# Altium project WreckerCar.PrjPcb
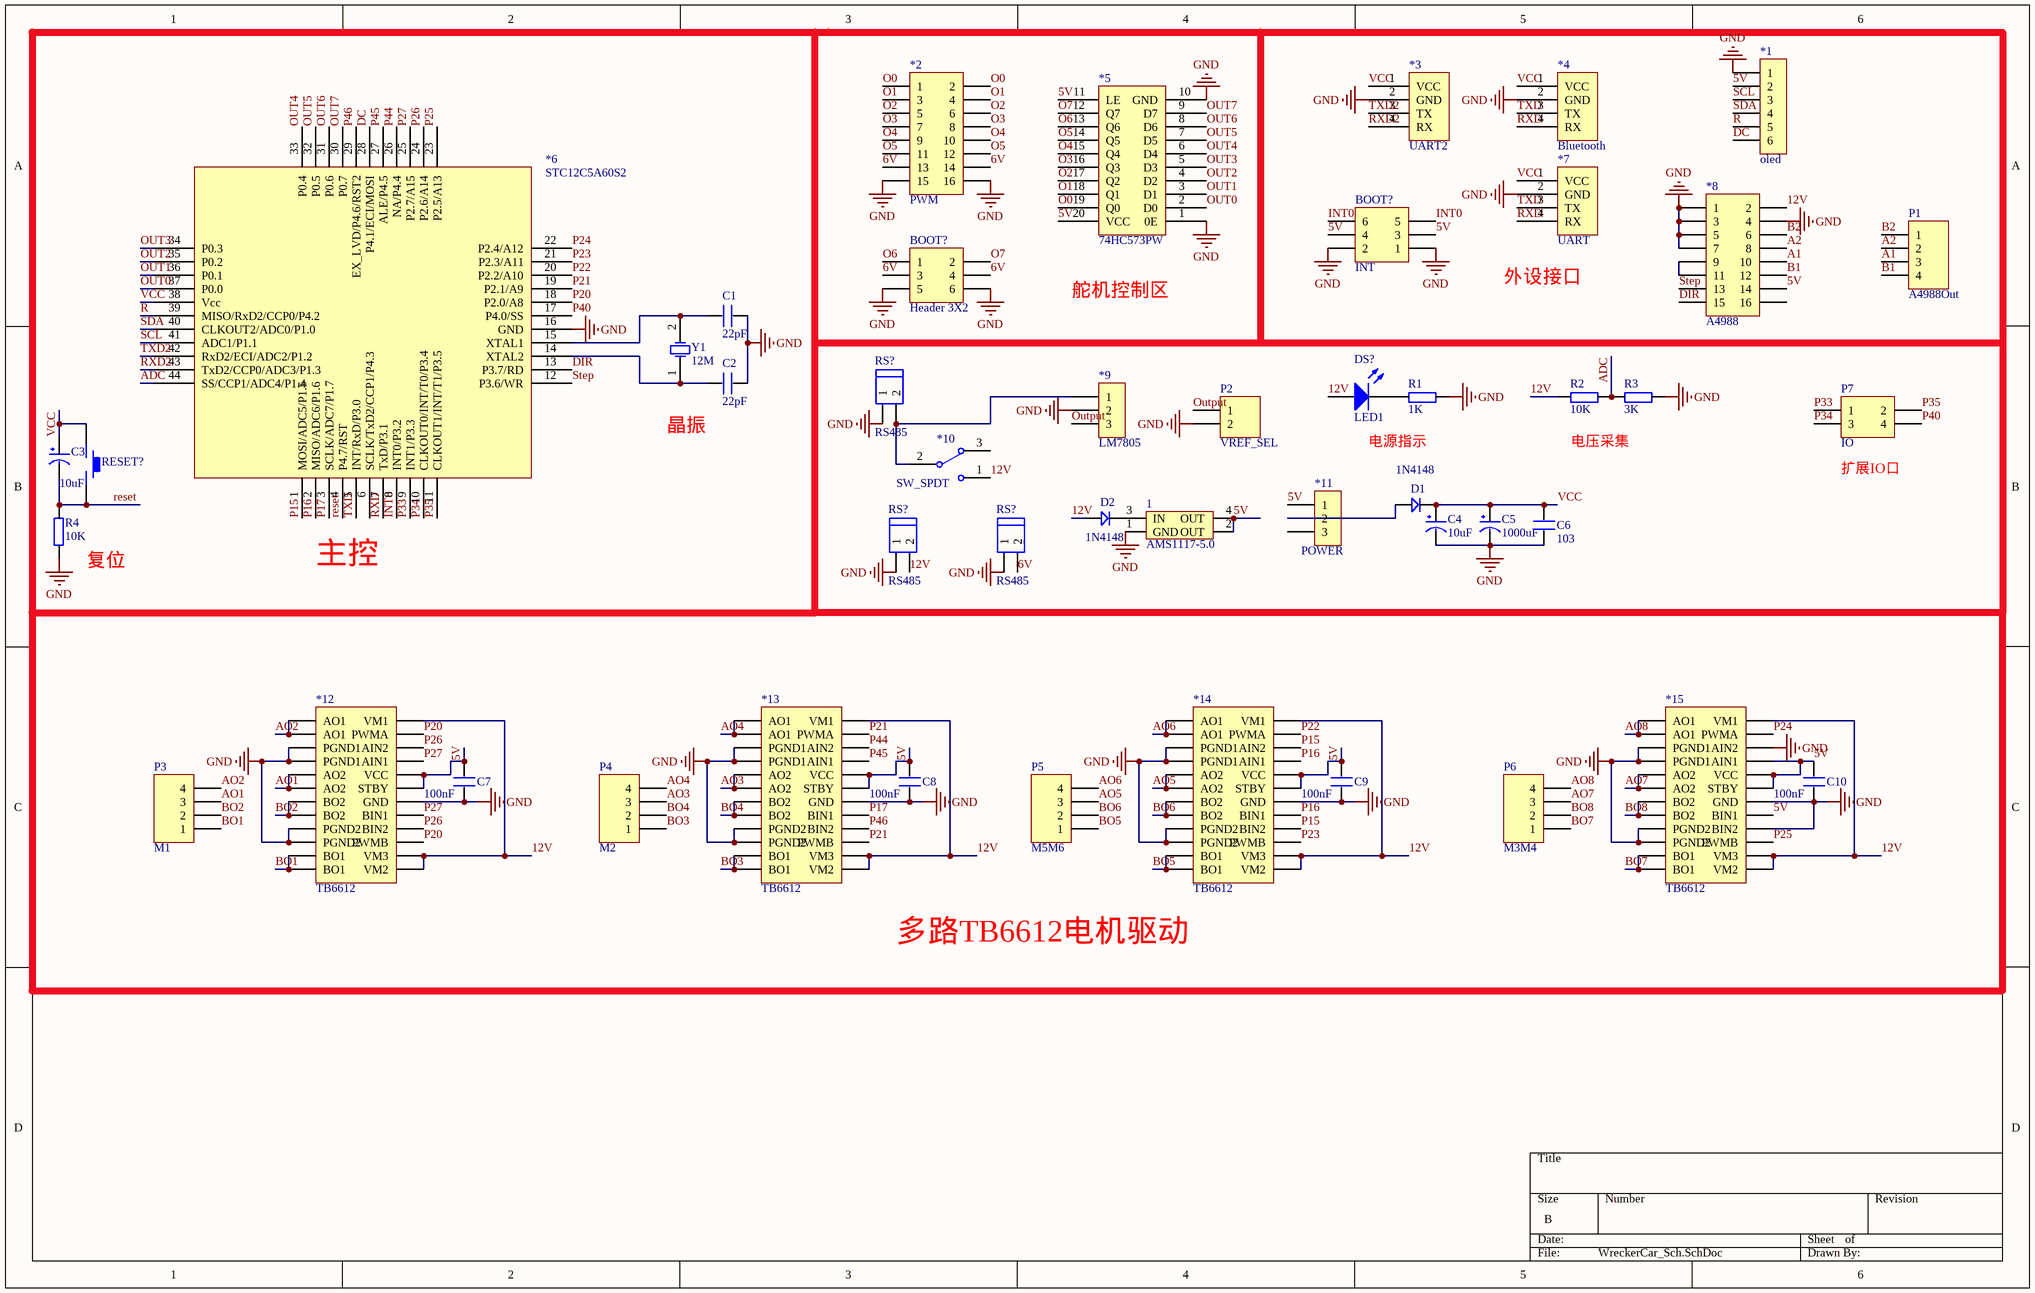
[diagram p0: WreckerCar_Sch.SchDoc]
1 sheet, 47 parts. Net scope: global (net labels, ports and power ports of the same name join across sheets).
Board file: WreckerCar_PCB.PcbDoc

## Sheet WreckerCar_Sch.SchDoc
size B

### Parts
(Parts that share a designator on the sheet are numbered #1, #2 ... from top to bottom, then left to right.)
1  AMS1117-5.0  [AMS1117]
*1  oled  [header1*6]
*2  PWM  [HEADER2*8]
*3  UART2  [HDR1X4]
*4  Bluetooth  [HDR1X4]
*5  74HC573PW  [TSSOP-20]
*6  STC12C5A60S2  [LQFP-44]
*7  UART  [HDR1X4]
*8  A4988  [A4988]
*9  LM7805  [header1*3]
*10  SW_SPDT  [钮子开关]
*11  POWER  [header1*3]
*12  TB6612  [TSOP65P760X120-24N]
*13  TB6612  [TSOP65P760X120-24N]
*14  TB6612  [TSOP65P760X120-24N]
*15  TB6612  [TSOP65P760X120-24N]
C1  22pF  [0603P]
C2  22pF  [0603P]
C3  10uF  [Cap10uF]
C4  10uF  [Cap10uF]
C5  1000uF  [Cap1000uF]
C6  103  [0603P]
C7  100nF  [0805]
C8  100nF  [0805]
C9  100nF  [0805]
C10  100nF  [0805]
D1  1N4148  [DIODE_SOP]
D2  1N4148  [DIODE_SOP]
DS  LED1  [SMDLED]
INT  INT  [HDR2X3]
P1  A4988Out  [HDR1X4]
P2  VREF_SEL  [HDR1X2]
P3  M1  [HDR1X4]
P4  M2  [HDR1X4]
P5  M5M6  [HDR1X4]
P6  M3M4  [HDR1X4]
P7  IO  [HDR2X2]
PWM2  Header 3X2  [HDR2X3]
R1  1K  [0603P]
R2  10K  [0603P]
R3  3K  [0603P]
R4  10K  [0603P]
RESET  KEY_M  [KEY]  (value not drawn)
RS#1  RS485  [HEAD2L-0.8]
RS#2  RS485  [HEAD2L-0.8]
RS#3  RS485  [HEAD2L-0.8]
Y1  12M  [XTAL_US]

### Nets
GND: 1.1(GND) *1.1 *2.15 *2.16 *3.2(GND) *4.2(GND) *5.1(0E) *5.10(GND) *6.16(GND) *7.2(GND) *8.1 *8.3 *8.4 *8.5 *8.7 *9.2 *12.3(PGND1) *12.4(PGND1) *12.9(PGND2) *12.10(PGND2) *12.18(GND) *13.3(PGND1) *13.4(PGND1) *13.9(PGND2) *13.10(PGND2) *13.18(GND) *14.3(PGND1) *14.4(PGND1) *14.9(PGND2) *14.10(PGND2) *14.18(GND) *15.3(PGND1) *15.4(PGND1) *15.9(PGND2) *15.10(PGND2) *15.16(BIN2) *15.18(GND) *15.22(AIN2) C1.2 C2.2 C4.2(GND) C5.2(GND) C6.1 C7.1 C8.1 C9.1 C10.1 INT.1 INT.2 P2.2 PWM2.5 PWM2.6 R1.2 R3.2 R4.2 RS#1.1 RS#2.1 RS#3.1
5V: 1.2(OUT) 1.4(OUT) *1.2 *5.11(LE) *5.20(VCC) *8.14 *11.1 *12.19(STBY) *12.20(VCC) *13.19(STBY) *13.20(VCC) *14.19(STBY) *14.20(VCC) *15.17(BIN1) *15.19(STBY) *15.20(VCC) *15.21(AIN1) C7.2 C8.2 C9.2 C10.2 INT.3 INT.4
6V: *2.13 *2.14 PWM2.3 PWM2.4 RS#3.2
12V: *8.2 *10.1 *12.13(VM2) *12.14(VM3) *12.24(VM1) *13.13(VM2) *13.14(VM3) *13.24(VM1) *14.13(VM2) *14.14(VM3) *14.24(VM1) *15.13(VM2) *15.14(VM3) *15.24(VM1) D2.1 DS.1(A) R2.1 RS#2.2
A1: *8.10 P1.3
A2: *8.8 P1.2
ADC: *6.44(SS/CCP1/ADC4/P1.4) R2.2 R3.1
AO1: *12.5(AO2) *12.6(AO2) P3.3
AO2: *12.1(AO1) *12.2(AO1) P3.4
AO3: *13.5(AO2) *13.6(AO2) P4.3
AO4: *13.1(AO1) *13.2(AO1) P4.4
AO5: *14.5(AO2) *14.6(AO2) P5.3
AO6: *14.1(AO1) *14.2(AO1) P5.4
AO7: *15.5(AO2) *15.6(AO2) P6.3
AO8: *15.1(AO1) *15.2(AO1) P6.4
B1: *8.12 P1.4
B2: *8.6 P1.1
BO1: *12.11(BO1) *12.12(BO1) P3.1
BO2: *12.7(BO2) *12.8(BO2) P3.2
BO3: *13.11(BO1) *13.12(BO1) P4.1
BO4: *13.7(BO2) *13.8(BO2) P4.2
BO5: *14.11(BO1) *14.12(BO1) P5.1
BO6: *14.7(BO2) *14.8(BO2) P5.2
BO7: *15.11(BO1) *15.12(BO1) P6.1
BO8: *15.7(BO2) *15.8(BO2) P6.2
DC: *1.6 *6.28(P4.1/ECI/MOSI)
DIR: *6.13(P3.7/RD) *8.15
INT0: *6.8(INT0/P3.2) INT.5 INT.6
O0: *2.1 *2.2 *5.19(Q0)
O1: *2.3 *2.4 *5.18(Q1)
O2: *2.5 *2.6 *5.17(Q2)
O3: *2.7 *2.8 *5.16(Q3)
O4: *2.9 *2.10 *5.15(Q4)
O5: *2.11 *2.12 *5.14(Q5)
O6: *5.13(Q6) PWM2.1
O7: *5.12(Q7) PWM2.2
OUT0: *5.2(D0) *6.37(P0.0)
OUT1: *5.3(D1) *6.36(P0.1)
OUT2: *5.4(D2) *6.35(P0.2)
OUT3: *5.5(D3) *6.34(P0.3)
OUT4: *5.6(D4) *6.33(P0.4)
OUT5: *5.7(D5) *6.32(P0.5)
OUT6: *5.8(D6) *6.31(P0.6)
OUT7: *5.9(D7) *6.30(P0.7)
Output: *9.3 P2.1
P15: *6.1(MOSI/ADC5/P1.5) *14.16(BIN2) *14.22(AIN2)
P16: *6.2(MISO/ADC6/P1.6) *14.17(BIN1) *14.21(AIN1)
P17: *6.3(SCLK/ADC7/P1.7) *13.17(BIN1)
P20: *6.18(P2.0/A8) *12.15(PWMB) *12.23(PWMA)
P21: *6.19(P2.1/A9) *13.15(PWMB) *13.23(PWMA)
P22: *6.20(P2.2/A10) *14.23(PWMA)
P23: *6.21(P2.3/A11) *14.15(PWMB)
P24: *6.22(P2.4/A12) *15.23(PWMA)
P25: *6.23(P2.5/A13) *15.15(PWMB)
P26: *6.24(P2.6/A14) *12.16(BIN2) *12.22(AIN2)
P27: *6.25(P2.7/A15) *12.17(BIN1) *12.21(AIN1)
P33: *6.9(INT1/P3.3) P7.1
P34: *6.10(CLKOUT0/INT/T0/P3.4) P7.3
P35: *6.11(CLKOUT1/INT/T1/P3.5) P7.2
P40: *6.17(P4.0/SS) P7.4
P44: *6.26(NA/P4.4) *13.22(AIN2)
P45: *6.27(ALE/P4.5) *13.21(AIN1)
P46: *6.29(EX_LVD/P4.6/RST2) *13.16(BIN2)
R: *1.5 *6.39(MISO/RxD2/CCP0/P4.2)
reset: *6.4(P4.7/RST) C3.2(GND) R4.1 RESET.2
RXD: *4.4(RX) *6.7(TxD/P3.1) *7.4(RX)
RXD2: *3.4(RX) *6.43(TxD2/CCP0/ADC3/P1.3)
SCL: *1.3 *6.41(ADC1/P1.1)
SDA: *1.4 *6.40(CLKOUT2/ADC0/P1.0)
Step: *6.12(P3.6/WR) *8.13
TXD: *4.3(TX) *6.5(INT/RxD/P3.0) *7.3(TX)
TXD2: *3.3(TX) *6.42(RxD2/ECI/ADC2/P1.2)
VCC: *3.1(VCC) *4.1(VCC) *6.38(Vcc) *7.1(VCC) C3.1(VCC) C4.1(VCC) C5.1(VCC) C6.2 D1.2 RESET.1
Net1_3: 1.3(IN) D2.2
Net*6_14: *6.14(XTAL2) C2.1 Y1.1(OSC1)
Net*6_15: *6.15(XTAL1) C1.1 Y1.2(OSC2)
Net*8_9: *8.9 *8.11
Net*9_1: *9.1 *10.2 RS#1.2
Net*11_2: *11.2 D1.1
NetDS_2: DS.2(K) R1.1

Not connected (* = marked no-connect by the designer): *6 6(SCLK/TxD2/CCP1/P4.3); *8 16; *10 3; *11 3

### Notes on the sheet
- 舵机控制区
- (near *7) 外设接口
- 晶振
- 电源指示
- 电压采集
- (near P7) 扩展IO口
- (near R4) 复位
- 主控
- 多路TB6612电机驱动

### Library data of the parts
1 = AMS1117
*1 = header1*6
*2 *8 = HEADER2*8
*3 *4 *7 = Header4booth
*9 *11 = header3*1
C1 C2 C6-C10 = C
C3-C5 = CAP
D1 D2 = D
DS = LED2: Typical RED, GREEN, YELLOW, AMBER GaAs LED
INT PWM2 = Header 3X2: Header, 3-Pin, Dual row
P1 P3-P6 = Header 4: Header, 4-Pin; LatestRevisionDate: 17-Jul-2002; LatestRevisionNote: Re-released for DXP Platform.; Publisher: Altium Limited
P2 = Header 2: Header, 2-Pin; LatestRevisionDate: 17-Jul-2002; LatestRevisionNote: Re-released for DXP Platform.; Publisher: Altium Limited
P7 = Header 2X2: Header, 2-Pin, Dual row; LatestRevisionDate: 17-Jul-2002; LatestRevisionNote: Re-released for DXP Platform.; Publisher: Altium Limited
R1-R4 = R
RS#1-RS#3 = HEAD2
Y1 = XTAL: Crystal Oscillator; Published: 8-Jun-2000; LatestRevisionDate: 17-Jul-2002; LatestRevisionNote: Re-released for DXP Platform.; Publisher: Altium Limited